# Altium schematic sheet Sheet1.SchDoc
size A3
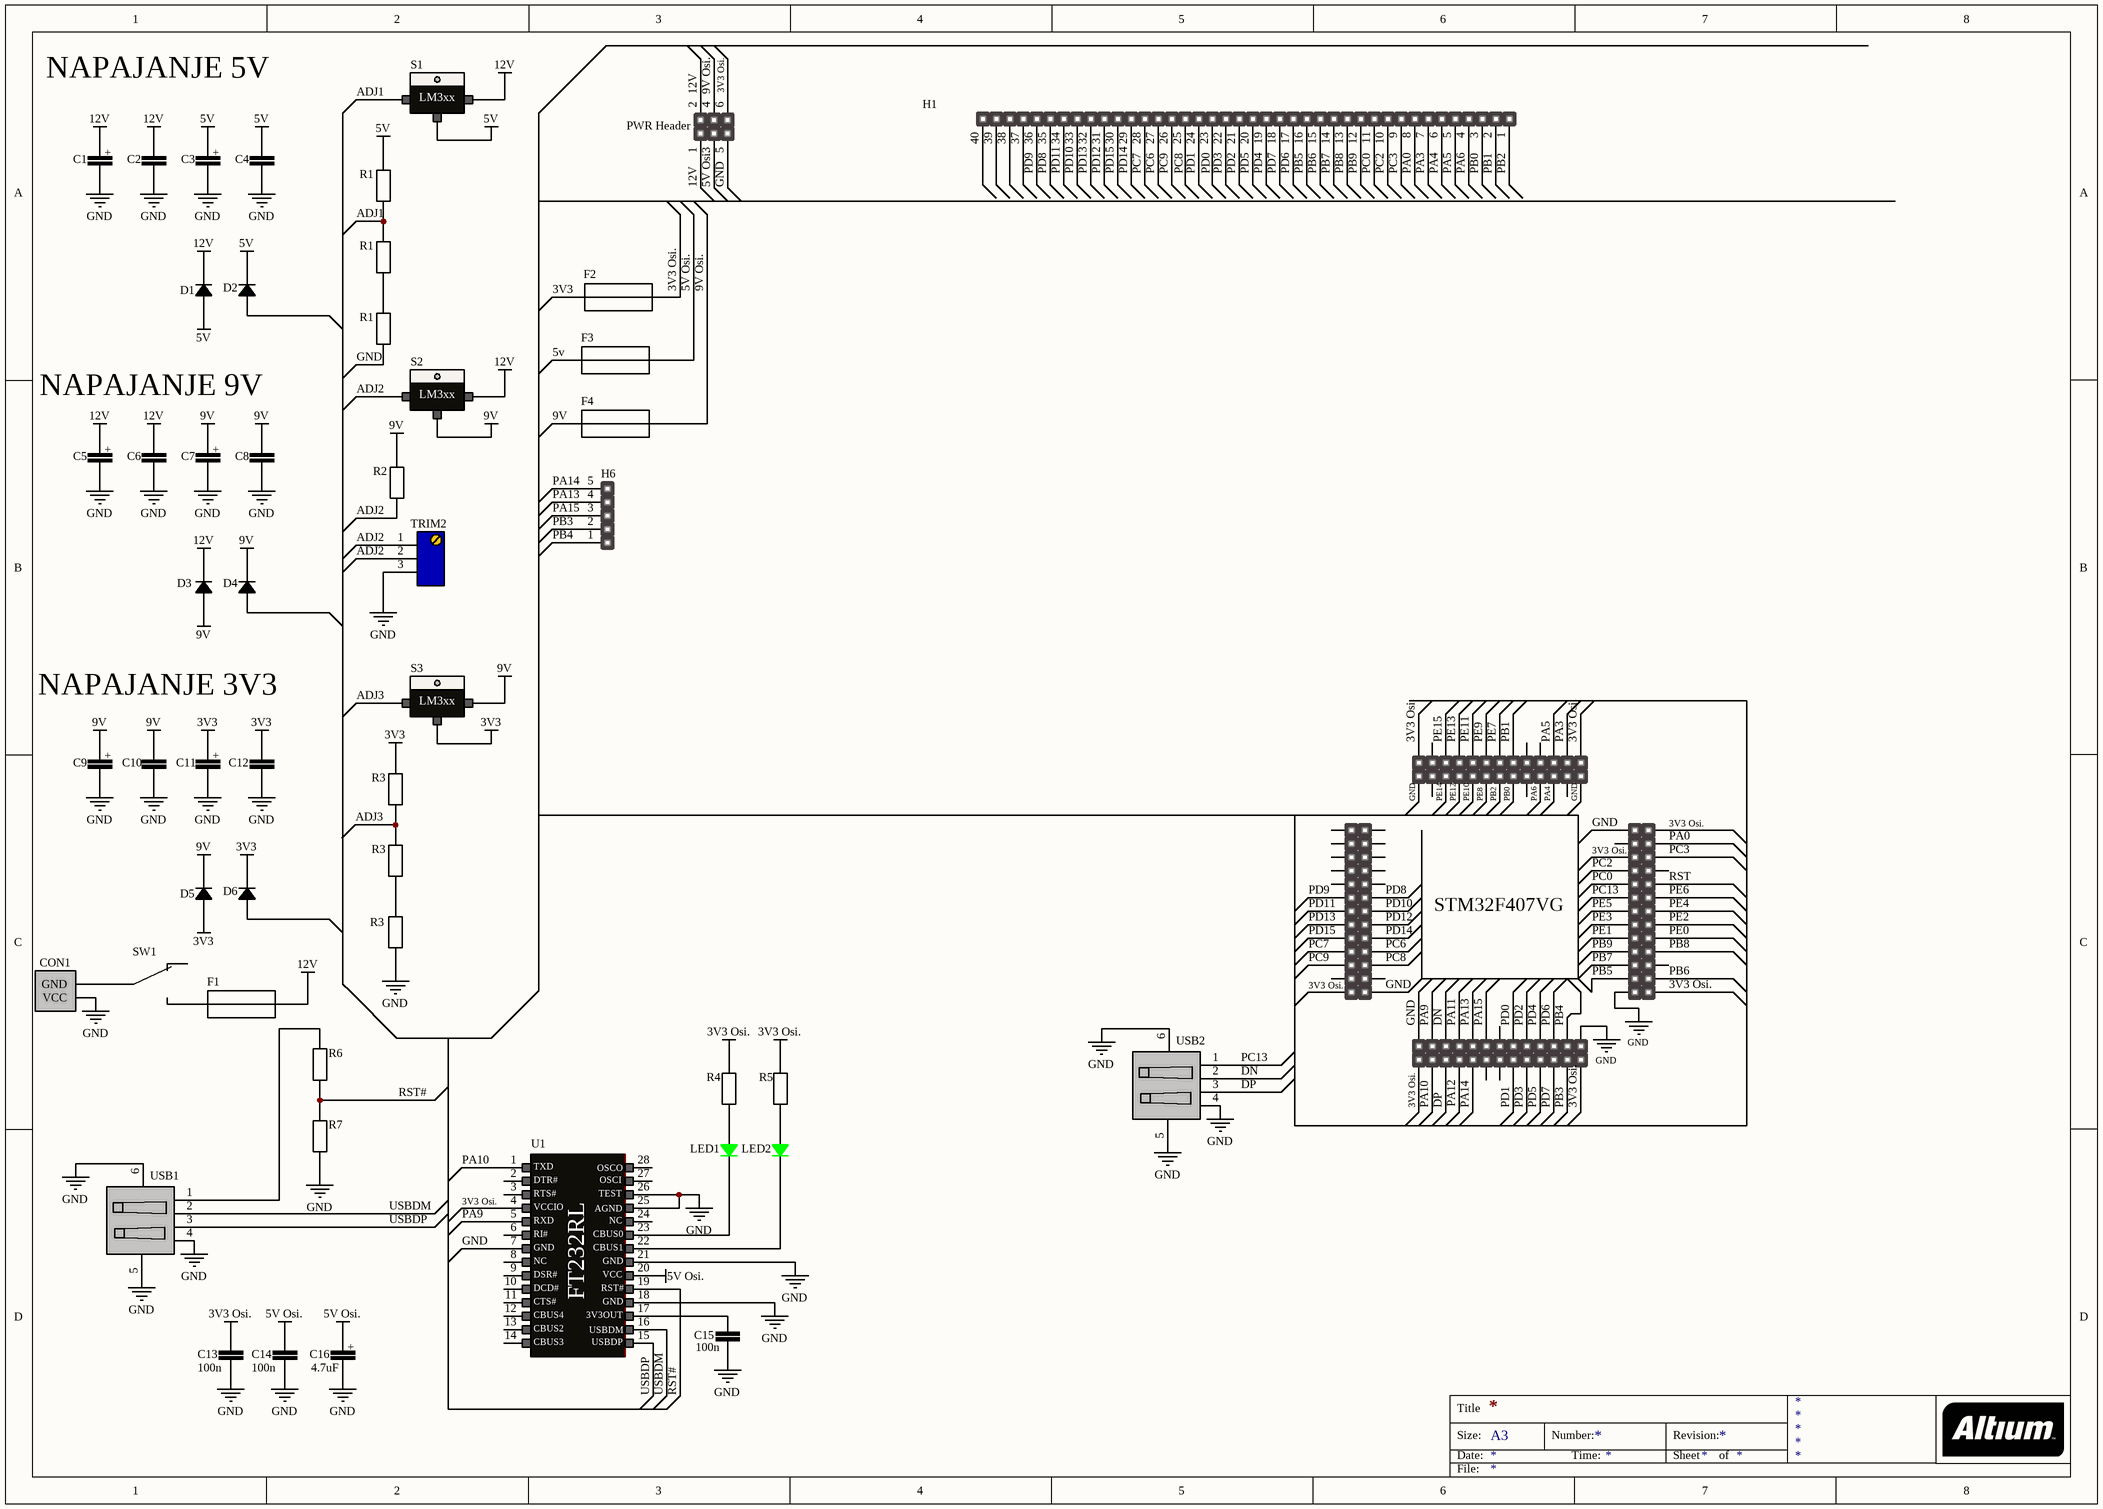
[diagram p0: Sheet1.SchDoc]

## Parts
(Parts that share a designator on the sheet are numbered #1, #2 ... from top to bottom, then left to right.)
C1  (no value)
C2  (no value)  [C1(150milsa)]
C3  (no value)
C4  (no value)  [C1(150milsa)]
C5  (no value)
C6  (no value)  [C1(150milsa)]
C7  (no value)
C8  (no value)  [C1(150milsa)]
C9  (no value)
C10  (no value)  [C1(150milsa)]
C11  (no value)
C12  (no value)  [C1(150milsa)]
C13  100n  [C1(150milsa)]
C14  100n  [C1(150milsa)]
C15  100n  [C1(150milsa)]
C16  4.7uF  [C2(elektrolit)]
CON1  (no value)
D1  (no value)  [D1(300milsa)]
D2  (no value)  [D1(300milsa)]
D3  (no value)  [D1(300milsa)]
D4  (no value)  [D1(300milsa)]
D5  (no value)  [D1(300milsa)]
D6  (no value)  [D1(300milsa)]
F1  (no value)
F2  (no value)
F3  (no value)
F4  (no value)
H1  (no value)
H6  (no value)
LED1  (no value)  [LED(3mm)]
LED2  (no value)  [LED(3mm)]
PWR_Header  (no value)
R1#1  (no value)  [R1(200milsa)]
R1#2  (no value)  [R1(200milsa)]
R1#3  (no value)  [R1(200milsa)]
R2  (no value)  [R1(200milsa)]
R3#1  (no value)  [R1(200milsa)]
R3#2  (no value)  [R1(200milsa)]
R3#3  (no value)  [R1(200milsa)]
R4  (no value)  [R1(200milsa)]
R5  (no value)  [R1(200milsa)]
R6  (no value)  [R1(200milsa)]
R7  (no value)  [R1(200milsa)]
S1  (no value)  [TO220]
S2  (no value)  [TO220]
S3  (no value)  [TO220]
STM32F407VG  (no value)  [STM32F407VG(ethernet)]
SW1  (no value)
TRIM2  (no value)
U1  (no value)  [FT232RL]
USB1  (no value)
USB2  (no value)

## Nets
3V3: C11.1 C12.2 D5.1 D6.2 F2.1 S3.2
3V3 Osi.: C13.1 F2.2 PWR_Header.6 R4.2 R5.2 STM32F407VG.25 STM32F407VG.27 STM32F407VG.51 STM32F407VG.53 STM32F407VG.74 STM32F407VG.77 STM32F407VG.79 STM32F407VG.103 U1.4
5v: C3.1 C4.2 D1.1 D2.2 F3.1 R1#1.2 S1.2
5V Osi.: C14.1 C16.1 F3.2 PWR_Header.3 U1.20
9V: C7.1 C8.2 C9.1 C10.2 D3.1 D4.2 D5.2 F4.1 R2.2 S2.2 S3.3
12V: C1.1 C2.2 C5.1 C6.2 D1.2 D3.2 F1.2 PWR_Header.1 PWR_Header.2 S1.3 S2.3
GND: C1.2 C2.1 C3.2 C4.1 C5.2 C6.1 C7.2 C8.1 C9.2 C10.1 C11.2 C12.1 C13.2 C14.2 C15.2 C16.2 CON1.1(VCC) PWR_Header.5 R1#3.1 R3#3.2 R7.2 STM32F407VG.26 STM32F407VG.28 STM32F407VG.52 STM32F407VG.54 STM32F407VG.78 STM32F407VG.80 STM32F407VG.104 TRIM2.3 U1.7 U1.18 U1.21 U1.25 U1.26 USB1.4 USB1.5 USB1.6 USB2.4 USB2.5 USB2.6
9V Osi.: F4.2 PWR_Header.4
ADJ1: R1#1.1 R1#2.2 S1.1
ADJ2: R2.1 S2.1 TRIM2.1 TRIM2.2
ADJ3: R3#1.1 R3#2.2 S3.1
DN: STM32F407VG.32 USB2.2
DP: STM32F407VG.31 USB2.3
PA0: H1.8 STM32F407VG.75
PA3: H1.7 STM32F407VG.81
PA4: H1.6 STM32F407VG.84
PA5: H1.5 STM32F407VG.83
PA6: H1.4 STM32F407VG.86
PA9: STM32F407VG.30 U1.5
PA10: STM32F407VG.29 U1.1
PA11: STM32F407VG.34
PA12: STM32F407VG.33
PA13: H6.4 STM32F407VG.36
PA14: H6.5 STM32F407VG.35
PA15: H6.3 STM32F407VG.38
PB0: H1.3 STM32F407VG.90
PB1: H1.2 STM32F407VG.89
PB2: H1.1 STM32F407VG.92
PB3: H6.2 STM32F407VG.49
PB4: H6.1 STM32F407VG.50
PB5: H1.16 STM32F407VG.56
PB6: H1.15 STM32F407VG.55
PB7: H1.14 STM32F407VG.58
PB8: H1.13 STM32F407VG.59
PB9: H1.12 STM32F407VG.60
PC0: H1.11 STM32F407VG.70
PC2: H1.10 STM32F407VG.72
PC3: H1.9 STM32F407VG.73
PC6: H1.27 STM32F407VG.20
PC7: H1.28 STM32F407VG.19
PC8: STM32F407VG.22
PC9: H1.26 STM32F407VG.21
PC13: STM32F407VG.68 USB2.1
PD0: STM32F407VG.42
PD1: H1.24 STM32F407VG.41
PD2: H1.21 STM32F407VG.44
PD3: H1.22 STM32F407VG.43
PD4: H1.19 STM32F407VG.46
PD5: H1.20 STM32F407VG.45
PD6: H1.17 STM32F407VG.48
PD7: H1.18 STM32F407VG.47
PD8: H1.35 STM32F407VG.12
PD9: H1.36 STM32F407VG.11
PD10: H1.33 STM32F407VG.14
PD11: H1.34 STM32F407VG.13
PD12: H1.31 STM32F407VG.16
PD13: H1.32 STM32F407VG.15
PD14: H1.29 STM32F407VG.18
PD15: H1.30 STM32F407VG.17
PE0: STM32F407VG.61
PE1: STM32F407VG.62
PE2: STM32F407VG.63
PE3: STM32F407VG.64
PE4: STM32F407VG.65
PE5: STM32F407VG.66
PE6: STM32F407VG.67
PE7: STM32F407VG.91
PE8: STM32F407VG.94
PE9: STM32F407VG.93
PE10: STM32F407VG.96
PE11: STM32F407VG.95
PE12: STM32F407VG.98
PE13: STM32F407VG.97
PE14: STM32F407VG.100
PE15: STM32F407VG.99
RST: STM32F407VG.69
RST#: R6.2 R7.1 U1.19
USBDM: U1.16 USB1.2
USBDP: U1.15 USB1.3
NetC15_1: C15.1 U1.17
NetCON1_2: CON1.2(GND) SW1.2
NetF1_1: F1.1 SW1.3
NetLED1_1: LED1.1 R4.1
NetLED1_2: LED1.2 U1.23
NetLED2_1: LED2.1 R5.1
NetLED2_2: LED2.2 U1.22
NetR1#2_1: R1#2.1 R1#3.2
NetR3#2_1: R3#2.1 R3#3.1
NetR6_1: R6.1 USB1.1

Not connected (* = marked no-connect by the designer): D2 1; D4 1; D6 1; H1 23 25 37 38 39 40; R3#1 2; STM32F407VG 1 2 3 4 5 6 7 8 9 10 23 24 37 39 40 57 71 76 82 85 87 88 101 102; SW1 1; U1 2 3 6 8 9 10 11 12 13 14 24 27 28

## Notes on the sheet
- NAPAJANJE 5V
- NAPAJANJE 9V
- NAPAJANJE 3V3
- Labels drawn without touching a wire or pin: 3V3, PC8, PD0
- Title
- Size:
- Date:
- A3
- Number:
- Time:
- Revision:
- Sheet
- of
- File:
- (in symbol C2) +
- (in symbol FT232) TXD; OSCO; DTR#; OSCI; RTS#; TEST; VCCIO; AGND; RXD; NC; RI#; CBUS0; GND; CBUS1; DSR#; VCC; DCD#; RST#; FT232RL; CTS#; CBUS4; 3V3OUT; CBUS2; USBDM; CBUS3; USBDP
- (in symbol LM317/LM350) LM3xx

## Library data of the parts
C1 C3 C5 C7 C9 C11 C16 = C2
C2 C4 C6 C8 C10 C12-C15 = C1
CON1 = PWR_CON
D1-D6 = D1
F1-F4 = FUSE
H1 = HEADER1X40
H6 = Header1x5
LED1 LED2 = LED
PWR_Header = Header2x3
R1#1-R1#3 R2 R3#1-R3#3 R4-R7 = R1
S1-S3 = LM317/LM350
STM32F407VG = STM32F407
SW1 = SW
TRIM2 = TRIM
U1 = FT232
USB1 USB2 = USB type B